# Altium project Aux Daq Board - Simplified.PrjPcb
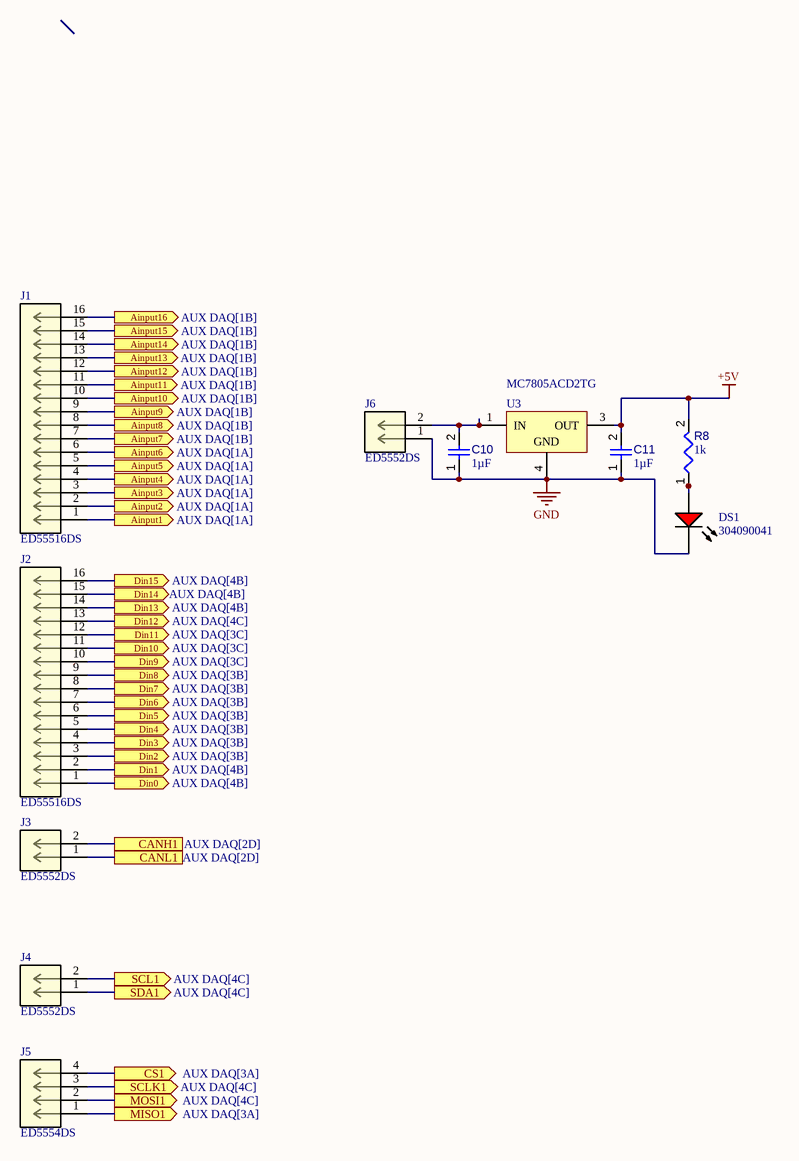
[diagram p0: Inputs.SchDoc]
2 sheets, 33 parts. Net scope: flat (ports and power ports of the same name join across sheets).
Board file: Aux Daq Simplified.PcbDoc
Sheets:
  Inputs.SchDoc
  AUX DAQ.SchDoc

## Sheet Inputs.SchDoc
size A4; SheetNumber: 1; SheetTotal: 2

### Parts
C10  value 1µF  [CAPC3216X180X20ML20]  (hidden comment: Capacitor 1 uF +/- 10% 25 V 1206)
C11  value 1µF  [CAPC3216X180X20ML20]  (hidden comment: Capacitor 1 uF +/- 10% 25 V 1206)
DS1  304090041  [LED-2P-2.28-3MM_A]  (no BOM)
J1  ED55516DS  [CONN16_ED555_56X6P5_OST]  (no BOM)
J2  ED55516DS  [CONN16_ED555_56X6P5_OST]  (no BOM)
J3  ED5552DS  [CONN_ED5552DS_OST]  (no BOM)
J4  ED5552DS  [CONN_ED5552DS_OST]  (no BOM)
J5  ED5554DS  [CONN4_ED5554DS_SHT]  (no BOM)
J6  ED5552DS  [CONN_ED5552DS_OST]
R8  value 1k  [RESC0805(2012)_L]  (hidden comment: Resistor 1K +/-5% 0805 125 mW)
U3  MC7805ACD2TG  [ONSC-D2PAK-3-936-03_V]  (no BOM)

### Ports
Ainput1 (out, see AUX DAQ[1A]), Ainput2 (out, see AUX DAQ[1A]), Ainput3 (out, see AUX DAQ[1A]), Ainput4 (out, see AUX DAQ[1A]), Ainput5 (out, see AUX DAQ[1A]), Ainput6 (out, see AUX DAQ[1A]), Ainput7 (out, see AUX DAQ[1B]), Ainput8 (out, see AUX DAQ[1B]), Ainput9 (out, see AUX DAQ[1B]), Ainput10 (out, see AUX DAQ[1B]), Ainput11 (out, see AUX DAQ[1B]), Ainput12 (out, see AUX DAQ[1B]), Ainput13 (out, see AUX DAQ[1B]), Ainput14 (out, see AUX DAQ[1B]), Ainput15 (out, see AUX DAQ[1B]), Ainput16 (out, see AUX DAQ[1B]), CANH1 (see AUX DAQ[2D]), CANL1 (see AUX DAQ[2D]), CS1 (out, see AUX DAQ[3A]), Din0 (out, see AUX DAQ[4B]), Din1 (out, see AUX DAQ[4B]), Din2 (out, see AUX DAQ[3B]), Din3 (out, see AUX DAQ[3B]), Din4 (out, see AUX DAQ[3B]), Din5 (out, see AUX DAQ[3B]), Din6 (out, see AUX DAQ[3B]), Din7 (out, see AUX DAQ[3B]), Din8 (out, see AUX DAQ[3B]), Din9 (out, see AUX DAQ[3C]), Din10 (out, see AUX DAQ[3C]), Din11 (out, see AUX DAQ[3C]), Din12 (out, see AUX DAQ[4C]), Din13 (out, see AUX DAQ[4B]), Din14 (out, see AUX DAQ[4B]), Din15 (out, see AUX DAQ[4B]), MISO1 (out, see AUX DAQ[3A]), MOSI1 (out, see AUX DAQ[4C]), SCL1 (out, see AUX DAQ[4C]), SCLK1 (out, see AUX DAQ[4C]), SDA1 (out, see AUX DAQ[4C])

### Nets
+5V: C11.2 R8.2 U3.3(OUT)
GND: C10.1 C11.1 DS1.2(K) J6.1 U3.4(GND)
NetC8_2: J3.2 ; port CANH1
NetC9_2: J3.1 ; port CANL1
NetC10_2: C10.2 J6.2 U3.1(IN)
NetDS1_1: DS1.1(A) R8.1
NetIC1_1: J1.4 ; port Ainput4
NetIC1_2: J1.3 ; port Ainput3
NetIC1_3: J1.2 ; port Ainput2
NetIC1_4: J1.1 ; port Ainput1
NetIC1_33: J1.16 ; port Ainput16
NetIC1_34: J1.15 ; port Ainput15
NetIC1_35: J1.14 ; port Ainput14
NetIC1_36: J1.13 ; port Ainput13
NetIC1_37: J1.12 ; port Ainput12
NetIC1_38: J1.11 ; port Ainput11
NetIC1_39: J1.10 ; port Ainput10
NetIC1_40: J1.9 ; port Ainput9
NetIC1_45: J1.8 ; port Ainput8
NetIC1_46: J1.7 ; port Ainput7
NetIC1_47: J1.6 ; port Ainput6
NetIC1_48: J1.5 ; port Ainput5
NetJ2_1: J2.1 ; port Din0
NetJ2_2: J2.2 ; port Din1
NetJ2_3: J2.3 ; port Din2
NetJ2_4: J2.4 ; port Din3
NetJ2_5: J2.5 ; port Din4
NetJ2_6: J2.6 ; port Din5
NetJ2_7: J2.7 ; port Din6
NetJ2_8: J2.8 ; port Din7
NetJ2_9: J2.9 ; port Din8
NetJ2_10: J2.10 ; port Din9
NetJ2_11: J2.11 ; port Din10
NetJ2_12: J2.12 ; port Din11
NetJ2_13: J2.13 ; port Din12
NetJ2_14: J2.14 ; port Din13
NetJ2_15: J2.15 ; port Din14
NetJ2_16: J2.16 ; port Din15
NetJ4_1: J4.1 ; port SDA1
NetJ4_2: J4.2 ; port SCL1
NetJ5_1: J5.1 ; port MISO1
NetJ5_2: J5.2 ; port MOSI1
NetJ5_3: J5.3 ; port SCLK1
NetJ5_4: J5.4 ; port CS1

### Library data of the parts
C10 C11 = CMP-001-00006-6: Chip Capacitor, 1 uF, +/- 10%, 25 V, 1206 (3216 Metric); Capacitor Type: Ceramic; Voltage Rating: 25V; Tolerance: 10%; Min Operating Temperature: -55°C; Pins: 2; Case/Package: 1206; Max Operating Temperature: 125°C; Mounting Technology: SM; RoHS Compliant: True
DS1 = CMP-007-00007-2: Red LED, 80 mW, 30 mA, -25 to 85 degC, 2-Pin THD; Manufacturer: Shenzhen CGX; Package Description: 2-Pin Through Hole Device, Dia 3 mm, Pitch 2.28 mm; Datasheet URL: http://datasheet.octopart.com/304090041-Chengguangxing-datasheet-62330656.pdf; Mounting Technology: TH; Manufacturer URL: http://szcgx.com/; RoHS Compliant: Unknown; Datasheet Version: Sep-14; Case/Package: 304090041; Package Reference: 304090041
J1 J2 = CMP-012-000000-1: No Description Available; Mfr_Name: On Shore Technology; Type: Type; Design Item ID: ED55516DS; RefDes: RefDes; Source: ED55516DS.SchLib
J3 J4 J6 = CMP-017-000000-1: No Description Available; Mfr_Name: On Shore Technology; Type: Type; Source: ED5552DS.SchLib; Design Item ID: ED5552DS; RefDes: RefDes
J5 = CMP-014-000000-1: No Description Available; Mfr_Name: On Shore Technology; Source: ED5554DS.SchLib; Type: Wire to Board; RefDes: RefDes; Design Item ID: ED5554DS
R8 = CMP-009-00118-3: Chip Resistor, 1 kOhms, +/-5%, 125 mW, -55 to 155 degC, 0805; Tolerance: 5%; Power: 125mW; Case/Package: 0805; Pins: 2; Min Operating Temperature: -55°C; Max Operating Temperature: 155°C
U3 = CMP-019-00027-3: Positive Voltage Regulator, 5 V Output Voltage, 1 A, 0 to 125 degC, 3-Pin D2PAK (936-03), Pb-Free, Tube; Manufacturer: ON Semiconductor; Min Input Voltage: 7V; Package Version: Rev. E, 09/2015; Output Voltage: 5V; Outputs: 1; Max Input Voltage: 35V; Output Current: 1A; Dropout Voltage: 2V; Mounting Technology: SM; Package Quantity: 50; Manufacturer URL: http://www.onsemi.com/; Package Reference: D2PAK-3-936-03; Nominal Output Voltage: 5V; Packaging: Rail/Tube; Max Operating Temperature: 125°C; Datasheet URL: http://www.onsemi.com/pub_link/Collateral/MC7800-D.PDF; RoHS Compliant: True; Datasheet Version: Rev. 27, 11/2014; Case/Package: TO-263-3; Min Operating Temperature: 0°C; Max Ouput Current: 1A; Package Description: 3-Pin Flange Mount, Body 10.02 x 9.1945 mm, Pitch 2.54 mm; Package URL: http://www.onsemi.com/pub_link/Collateral/936-03.PDF; Pins: 3

## Sheet AUX DAQ.SchDoc: ADC Mapping
size A4; DrawnBy: Glenn Zhang; Revision: 1.0; SheetNumber: 2; SheetTotal: 2
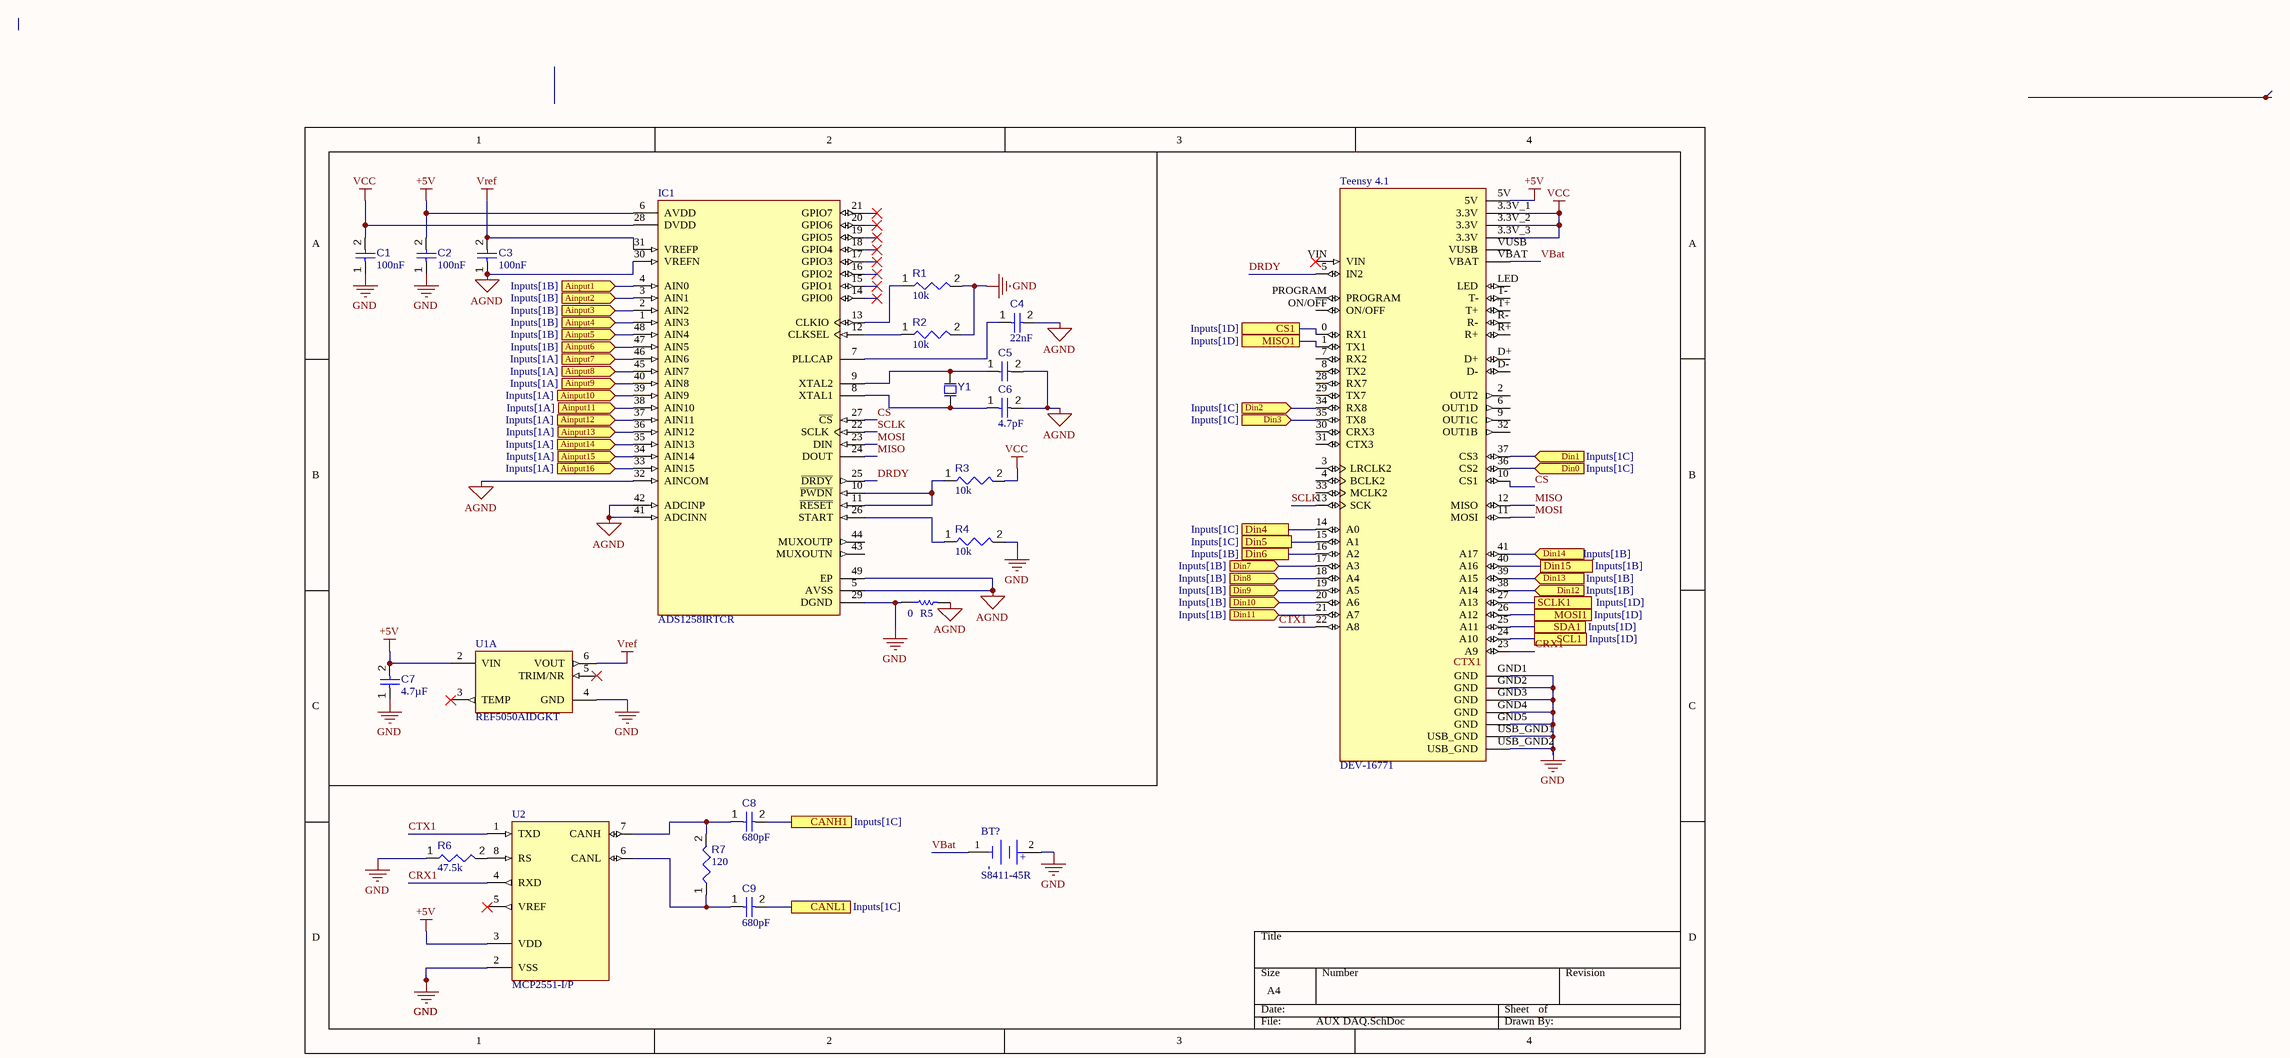
[diagram p1: AUX DAQ.SchDoc]

### Parts
BT?  S8411-45R  [FP-S8411-45R-MFG]
C1  value 100nF  [CAPC0402(1005)60_L]  (hidden comment: Capacitor 100nF +/-20% 50V 0402)
C2  value 100nF  [CAPC0402(1005)60_L]  (hidden comment: Capacitor 100nF +/-20% 50V 0402)
C3  value 100nF  [CAPC0402(1005)60_L]  (hidden comment: Capacitor 100nF +/-20% 50V 0402)
C4  value 22nF  [CAPC0402(1005)60_L]  (hidden comment: Capacitor 22nF +/-20% 10V 0402)
C5  C0402C479C5GACTU  [CAPC1005X55N]  (value not drawn)
C6  value 4.7pF  [CAPC1005X55N]  (hidden comment: C0402C479C5GACTU)
C7  value 4.7µF  [CAPC0805(2012)145_L]  (hidden comment: Capacitor 4.7µF +/-40% 25V 0805)
C8  value 680pF  [CAPC0402(1005)33_L]  (hidden comment: Capacitor 680pF +/-20% 50V 0402)
C9  value 680pF  [CAPC0402(1005)33_L]  (hidden comment: Capacitor 680pF +/-20% 50V 0402)
IC1  ADS1258IRTCR  [FP-RTC0048A-IPC_C]
R1  value 10k  [RESC0402(1005)_L]  (hidden comment: 10KR2F)
R2  value 10k  [RESC0402(1005)_L]  (hidden comment: 10KR2F)
R3  value 10k  [RESC0402(1005)_L]  (hidden comment: 10KR2F)
R4  value 10k  [RESC0402(1005)_L]  (hidden comment: 10KR2F)
R5  value 0  [RESC1005X40X25ML05T10]  (hidden comment: Resistor 0R 0402 63 mW)
R6  value 47.5k  [RESC0402(1005)_L]  (hidden comment: 47D5KR2F)
R7  value 120  [RESC0603(1608)_L]  (hidden comment: Resistor 120R +/-5 % 0603 0.1 W)
Teensy_4.1  DEV-16771  [MODULE_DEV-16771]  (no BOM)
U1  REF5050AIDGKT  [DGK0008A_M]  (part A of 2)
U2  MCP2551-I/P  [PDIP300-P8]
Y1  ABS07-166-32.768KHZ-T  [EPSON-FC-135_V]  (value not drawn)

### Ports
Ainput1 (in, see Inputs[1B]), Ainput2 (in, see Inputs[1B]), Ainput3 (in, see Inputs[1B]), Ainput4 (in, see Inputs[1B]), Ainput5 (in, see Inputs[1B]), Ainput6 (in, see Inputs[1B]), Ainput7 (in, see Inputs[1A]), Ainput8 (in, see Inputs[1A]), Ainput9 (in, see Inputs[1A]), Ainput10 (in, see Inputs[1A]), Ainput11 (in, see Inputs[1A]), Ainput12 (in, see Inputs[1A]), Ainput13 (in, see Inputs[1A]), Ainput14 (in, see Inputs[1A]), Ainput15 (in, see Inputs[1A]), Ainput16 (in, see Inputs[1A]), CANH1 (see Inputs[1C]), CANL1 (see Inputs[1C]), CS1 (see Inputs[1D]), Din0 (in, see Inputs[1C]), Din1 (in, see Inputs[1C]), Din2 (in, see Inputs[1C]), Din3 (in, see Inputs[1C]), Din4 (see Inputs[1C]), Din5 (see Inputs[1C]), Din6 (see Inputs[1B]), Din7 (in, see Inputs[1B]), Din8 (in, see Inputs[1B]), Din9 (in, see Inputs[1B]), Din10 (in, see Inputs[1B]), Din11 (in, see Inputs[1B]), Din12 (in, see Inputs[1B]), Din13 (in, see Inputs[1B]), Din14 (in, see Inputs[1B]), Din15 (see Inputs[1B]), MISO1 (see Inputs[1D]), MOSI1 (see Inputs[1D]), SCL1 (see Inputs[1D]), SCLK1 (see Inputs[1D]), SDA1 (see Inputs[1D])

### Nets
+5V: C2.2 C7.2 IC1.6(AVDD) Teensy_4.1.5V U1.2(VIN) U2.3(VDD)
AGND: C3.1 C4.2 C5.2 C6.2 IC1.5(AVSS) IC1.30(VREFN) IC1.32(AINCOM) IC1.41(ADCINN) IC1.42(ADCINP) IC1.49(EP) R5.2
GND: BT?.2(A) C1.1 C2.1 C7.1 IC1.29(DGND) R1.2 R2.2 R4.2 R5.1 R6.1 Teensy_4.1.GND1(GND) Teensy_4.1.GND2(GND) Teensy_4.1.GND3(GND) Teensy_4.1.GND4(GND) Teensy_4.1.GND5(GND) Teensy_4.1.USB_GND1(USB_GND) Teensy_4.1.USB_GND2(USB_GND) U1.4(GND) U2.2(VSS)
VCC: C1.2 IC1.28(DVDD) R3.2 Teensy_4.1.3.3V_1(3.3V) Teensy_4.1.3.3V_2(3.3V) Teensy_4.1.3.3V_3(3.3V)
Vref: C3.2 IC1.31(VREFP) U1.6(VOUT)
CRX1: Teensy_4.1.23(A9) U2.4(RXD)
CS: IC1.27(~{CS}) Teensy_4.1.10(CS1)
CTX1: Teensy_4.1.22(A8) U2.1(TXD)
DRDY: IC1.25(~{DRDY}) Teensy_4.1.5(IN2)
MISO: IC1.24(DOUT) Teensy_4.1.12(MISO)
MOSI: IC1.23(DIN) Teensy_4.1.11(MOSI)
SCLK: IC1.22(SCLK) Teensy_4.1.13(SCK)
VBat: BT?.1(C) Teensy_4.1.VBAT
NetC4_1: C4.1 IC1.7(PLLCAP)
NetC5_1: C5.1 IC1.9(XTAL2) Y1.2
NetC6_1: C6.1 IC1.8(XTAL1) Y1.1
NetC8_1: C8.1 R7.2 U2.7(CANH)
NetC8_2: C8.2 ; port CANH1
NetC9_1: C9.1 R7.1 U2.6(CANL)
NetC9_2: C9.2 ; port CANL1
NetIC1_1: IC1.1(AIN3) ; port Ainput4
NetIC1_2: IC1.2(AIN2) ; port Ainput3
NetIC1_3: IC1.3(AIN1) ; port Ainput2
NetIC1_4: IC1.4(AIN0) ; port Ainput1
NetIC1_10: IC1.10(~{PWDN}) IC1.11(~{RESET}) R3.1
NetIC1_12: IC1.12(CLKSEL) R2.1
NetIC1_13: IC1.13(CLKIO) R1.1
NetIC1_26: IC1.26(START) R4.1
NetIC1_33: IC1.33(AIN15) ; port Ainput16
NetIC1_34: IC1.34(AIN14) ; port Ainput15
NetIC1_35: IC1.35(AIN13) ; port Ainput14
NetIC1_36: IC1.36(AIN12) ; port Ainput13
NetIC1_37: IC1.37(AIN11) ; port Ainput12
NetIC1_38: IC1.38(AIN10) ; port Ainput11
NetIC1_39: IC1.39(AIN9) ; port Ainput10
NetIC1_40: IC1.40(AIN8) ; port Ainput9
NetIC1_45: IC1.45(AIN7) ; port Ainput8
NetIC1_46: IC1.46(AIN6) ; port Ainput7
NetIC1_47: IC1.47(AIN5) ; port Ainput6
NetIC1_48: IC1.48(AIN4) ; port Ainput5
NetJ2_1: Teensy_4.1.36(CS2) ; port Din0
NetJ2_2: Teensy_4.1.37(CS3) ; port Din1
NetJ2_3: Teensy_4.1.34(RX8) ; port Din2
NetJ2_4: Teensy_4.1.35(TX8) ; port Din3
NetJ2_5: Teensy_4.1.14(A0) ; port Din4
NetJ2_6: Teensy_4.1.15(A1) ; port Din5
NetJ2_7: Teensy_4.1.16(A2) ; port Din6
NetJ2_8: Teensy_4.1.17(A3) ; port Din7
NetJ2_9: Teensy_4.1.18(A4) ; port Din8
NetJ2_10: Teensy_4.1.19(A5) ; port Din9
NetJ2_11: Teensy_4.1.20(A6) ; port Din10
NetJ2_12: Teensy_4.1.21(A7) ; port Din11
NetJ2_13: Teensy_4.1.38(A14) ; port Din12
NetJ2_14: Teensy_4.1.39(A15) ; port Din13
NetJ2_15: Teensy_4.1.41(A17) ; port Din14
NetJ2_16: Teensy_4.1.40(A16) ; port Din15
NetJ4_1: Teensy_4.1.25(A11) ; port SDA1
NetJ4_2: Teensy_4.1.24(A10) ; port SCL1
NetJ5_1: Teensy_4.1.1(TX1) ; port MISO1
NetJ5_2: Teensy_4.1.26(A12) ; port MOSI1
NetJ5_3: Teensy_4.1.27(A13) ; port SCLK1
NetJ5_4: Teensy_4.1.0(RX1) ; port CS1
NetR6_2: R6.2 U2.8(RS)

Not connected (* = marked no-connect by the designer): IC1 14(GPIO0)* 15(GPIO1)* 16(GPIO2)* 17(GPIO3)* 18(GPIO4)* 19(GPIO5)* 20(GPIO6)* 21(GPIO7)* 43(MUXOUTN) 44(MUXOUTP); Teensy_4.1 2(OUT2) 3(LRCLK2) 4(BCLK2) 6(OUT1D) 7(RX2) 8(TX2) 9(OUT1C) 28(RX7) 29(TX7) 30(CRX3) 31(CTX3) 32(OUT1B) 33(MCLK2) D+ D- LED ON/OFF PROGRAM R+ R- T+ T- VIN* VUSB; U1 3(TEMP)* 5(TRIM/NR)*; U2 5(VREF)*

### Notes on the sheet
- Labels drawn without touching a wire or pin: CTX1
- (in symbol CMP-15817-000007-1) +; -

### Library data of the parts
BT? = CMP-15817-000007-1: BATTERY HOLDER COIN 12MM SMD; Number of Batteries: 1; Material: Polyphenylene; Case/Package: SMD/SMT; Number of Cells: 1; Min Operating Temperature: -55°C; Termination: SMD/SMT; REACH SVHC: No SVHC; Contact Plating: Bronze; Package Quantity: 500; Max Operating Temperature: 105°C; Mount: Surface Mount; Packaging: Tape and Reel
C1-C3 = CMP-001-00067-3: Chip Capacitor, 100nF +/-20%, 50V, 0402, Thickness 0.6 mm; Tolerance: 10%; Min Operating Temperature: -55°C; Pins: 2; Case/Package: 0402; Max Operating Temperature: 85°C; Voltage Rating: 50V; Mounting Technology: SMT
C4 = CMP-001-00062-3: Chip Capacitor, 22nF +/-20%, 10V, 0402, Thickness 0.6 mm; Tolerance: 10%; Min Operating Temperature: -55°C; Case/Package: 0402; Pins: 2; Max Operating Temperature: 85°C; Mounting Technology: SMT; Voltage Rating: 10V
C5 = CMP-001-00083-2: Ceramic Capacitor, Multilayer, Ceramic, 50V, 5.32% +Tol, 5.32% -Tol, C0G, 30ppm/Cel TC, 0.0000047uF, Surface Mount, 0402; Value: 4.7pF; Max Operating Temperature: 125°C; Pins: 2; Min Operating Temperature: -55°C; Capacitor Type: Ceramic; Mounting Technology: Surface Mount; RoHS Compliant: Yes; Case/Package: 0402
C6 = CMP-001-00083-2: Ceramic Capacitor, Multilayer, Ceramic, 50V, 5.32% +Tol, 5.32% -Tol, C0G, 30ppm/Cel TC, 0.0000047uF, Surface Mount, 0402; Max Operating Temperature: 125°C; Pins: 2; Min Operating Temperature: -55°C; Capacitor Type: Ceramic; Mounting Technology: Surface Mount; RoHS Compliant: Yes; Case/Package: 0402
C7 = CMP-001-00080-4: Chip Capacitor, 4.7µF +/-40%, 25V, 0805, Thickness 1.45 mm; Tolerance: 20%; Voltage Rating: 25V; Min Operating Temperature: -55°C; Max Operating Temperature: 85°C; Pins: 2; Mounting Technology: SMT; Case/Package: 0805
C8 C9 = CMP-001-00070-3: Chip Capacitor, 680pF +/-20%, 50V, 0402, Thickness 0.33 mm; Tolerance: 10%; Max Operating Temperature: 85°C; Pins: 2; Min Operating Temperature: -55°C; Voltage Rating: 50V; Mounting Technology: SMT; Case/Package: 0402
IC1 = CMP-031-00009-1: ADC, Delta-Sigma, 24-Bit, 1 Func, 16 Channel, Serial Access, PQCC48; Min Operating Temperature: -40°C; RoHS Compliant: Yes; Case/Package: HVQCCN; Pins: 48; Max Operating Temperature: 105°C
R1-R4 = CMP-009-00066-2: 10K 0.063W 1% 0402 (1005 Metric)  SMD; Power: 63mW; Case/Package: 0402; Mounting Technology: SMT; Pins: 2; Tolerance: 1%
R5 = CMP-009-00004-5: Chip Resistor, 0 Ohm, 0.063 W, -55 to 155 degC, 0402 (1005 Metric); Power: 63mW; Voltage Rating: 50V; Max Operating Temperature: 155°C; Pins: 2; RoHS Compliant: True; Min Operating Temperature: -55°C; Mounting Technology: SM; Case/Package: 0402
R6 = CMP-009-00103-2: 47K5 0.063W 1% 0402 (1005 Metric)  SMD; Power: 63mW; Pins: 2; Tolerance: 1%; Mounting Technology: SMT; Case/Package: 0402
R7 = CMP-009-00176-3: Chip Resistor, 120 Ohms, +/-5 %, 0.1 W, -55 to 155 degC, 0603; Power: 100mW; Tolerance: 5%; Max Operating Temperature: 155°C; Pins: 2; Case/Package: 0603; Min Operating Temperature: -55°C
Teensy_4.1 = CMP-003-000000-1: RT1062 Teensy 4.1 series ARM?Cortex?M7 MPU Embedded Evaluation Board; MF: SparkFun Electronics; Value: *; Source: DEV-16771.SchLib; Pin Count: 65; Package: None; MP: DEV-16771; Design Item ID: DEV-16771; Check_prices: https://www.snapeda.com/parts/DEV-16771/SparkFun+Electronics/view-part/?ref=eda; SnapEDA_Link: https://www.snapeda.com/parts/DEV-16771/SparkFun+Electronics/view-part/?ref=snap; Component Type: Standard
U1 = CMP-00030-00001-1: Three Terminal Voltage Reference, 1 Output, 5V, Trim/Adjustable, PDSO8; Max Operating Temperature: 125°C; Pins: 8; Min Operating Temperature: -40°C; RoHS Compliant: Yes; Case/Package: TSSOP
U2 = CMP-031-00006-1: CAN Transceiver, 1-Trnsvr, PDIP8; RoHS Compliant: Yes; Min Operating Temperature: -40°C; Case/Package: DIP; Pins: 8; Max Operating Temperature: 85°C
Y1 = CMP-003-00029-1: Crystal 32.768kHz 10ppm 7pF -40C +85C; Pins: 2; Frequency: 32.768kHz

## Nets that join several sheets
+5V: Inputs (C11.2 R8.2 U3.3), AUX DAQ (6 pins)
GND: Inputs (5 pins), AUX DAQ (19 pins)
NetC8_2: Inputs (J3.2), AUX DAQ (C8.2)
NetC9_2: Inputs (J3.1), AUX DAQ (C9.2)
NetIC1_1: Inputs (J1.4), AUX DAQ (IC1.1)
NetIC1_2: Inputs (J1.3), AUX DAQ (IC1.2)
NetIC1_3: Inputs (J1.2), AUX DAQ (IC1.3)
NetIC1_4: Inputs (J1.1), AUX DAQ (IC1.4)
NetIC1_33: Inputs (J1.16), AUX DAQ (IC1.33)
NetIC1_34: Inputs (J1.15), AUX DAQ (IC1.34)
NetIC1_35: Inputs (J1.14), AUX DAQ (IC1.35)
NetIC1_36: Inputs (J1.13), AUX DAQ (IC1.36)
NetIC1_37: Inputs (J1.12), AUX DAQ (IC1.37)
NetIC1_38: Inputs (J1.11), AUX DAQ (IC1.38)
NetIC1_39: Inputs (J1.10), AUX DAQ (IC1.39)
NetIC1_40: Inputs (J1.9), AUX DAQ (IC1.40)
NetIC1_45: Inputs (J1.8), AUX DAQ (IC1.45)
NetIC1_46: Inputs (J1.7), AUX DAQ (IC1.46)
NetIC1_47: Inputs (J1.6), AUX DAQ (IC1.47)
NetIC1_48: Inputs (J1.5), AUX DAQ (IC1.48)
NetJ2_1: Inputs (J2.1), AUX DAQ (Teensy_4.1.36)
NetJ2_2: Inputs (J2.2), AUX DAQ (Teensy_4.1.37)
NetJ2_3: Inputs (J2.3), AUX DAQ (Teensy_4.1.34)
NetJ2_4: Inputs (J2.4), AUX DAQ (Teensy_4.1.35)
NetJ2_5: Inputs (J2.5), AUX DAQ (Teensy_4.1.14)
NetJ2_6: Inputs (J2.6), AUX DAQ (Teensy_4.1.15)
NetJ2_7: Inputs (J2.7), AUX DAQ (Teensy_4.1.16)
NetJ2_8: Inputs (J2.8), AUX DAQ (Teensy_4.1.17)
NetJ2_9: Inputs (J2.9), AUX DAQ (Teensy_4.1.18)
NetJ2_10: Inputs (J2.10), AUX DAQ (Teensy_4.1.19)
NetJ2_11: Inputs (J2.11), AUX DAQ (Teensy_4.1.20)
NetJ2_12: Inputs (J2.12), AUX DAQ (Teensy_4.1.21)
NetJ2_13: Inputs (J2.13), AUX DAQ (Teensy_4.1.38)
NetJ2_14: Inputs (J2.14), AUX DAQ (Teensy_4.1.39)
NetJ2_15: Inputs (J2.15), AUX DAQ (Teensy_4.1.41)
NetJ2_16: Inputs (J2.16), AUX DAQ (Teensy_4.1.40)
NetJ4_1: Inputs (J4.1), AUX DAQ (Teensy_4.1.25)
NetJ4_2: Inputs (J4.2), AUX DAQ (Teensy_4.1.24)
NetJ5_1: Inputs (J5.1), AUX DAQ (Teensy_4.1.1)
NetJ5_2: Inputs (J5.2), AUX DAQ (Teensy_4.1.26)
NetJ5_3: Inputs (J5.3), AUX DAQ (Teensy_4.1.27)
NetJ5_4: Inputs (J5.4), AUX DAQ (Teensy_4.1.0)